# EasyEDA schematic SCH_Active-P1-DSMR-Switch_2025-04-20.json
TITLE: Smart P1 Splitter; REV: 2; Date: 2024-4-21; Sheet: 1/1; Drawn By: Jacco Bezemer; Company: BITS
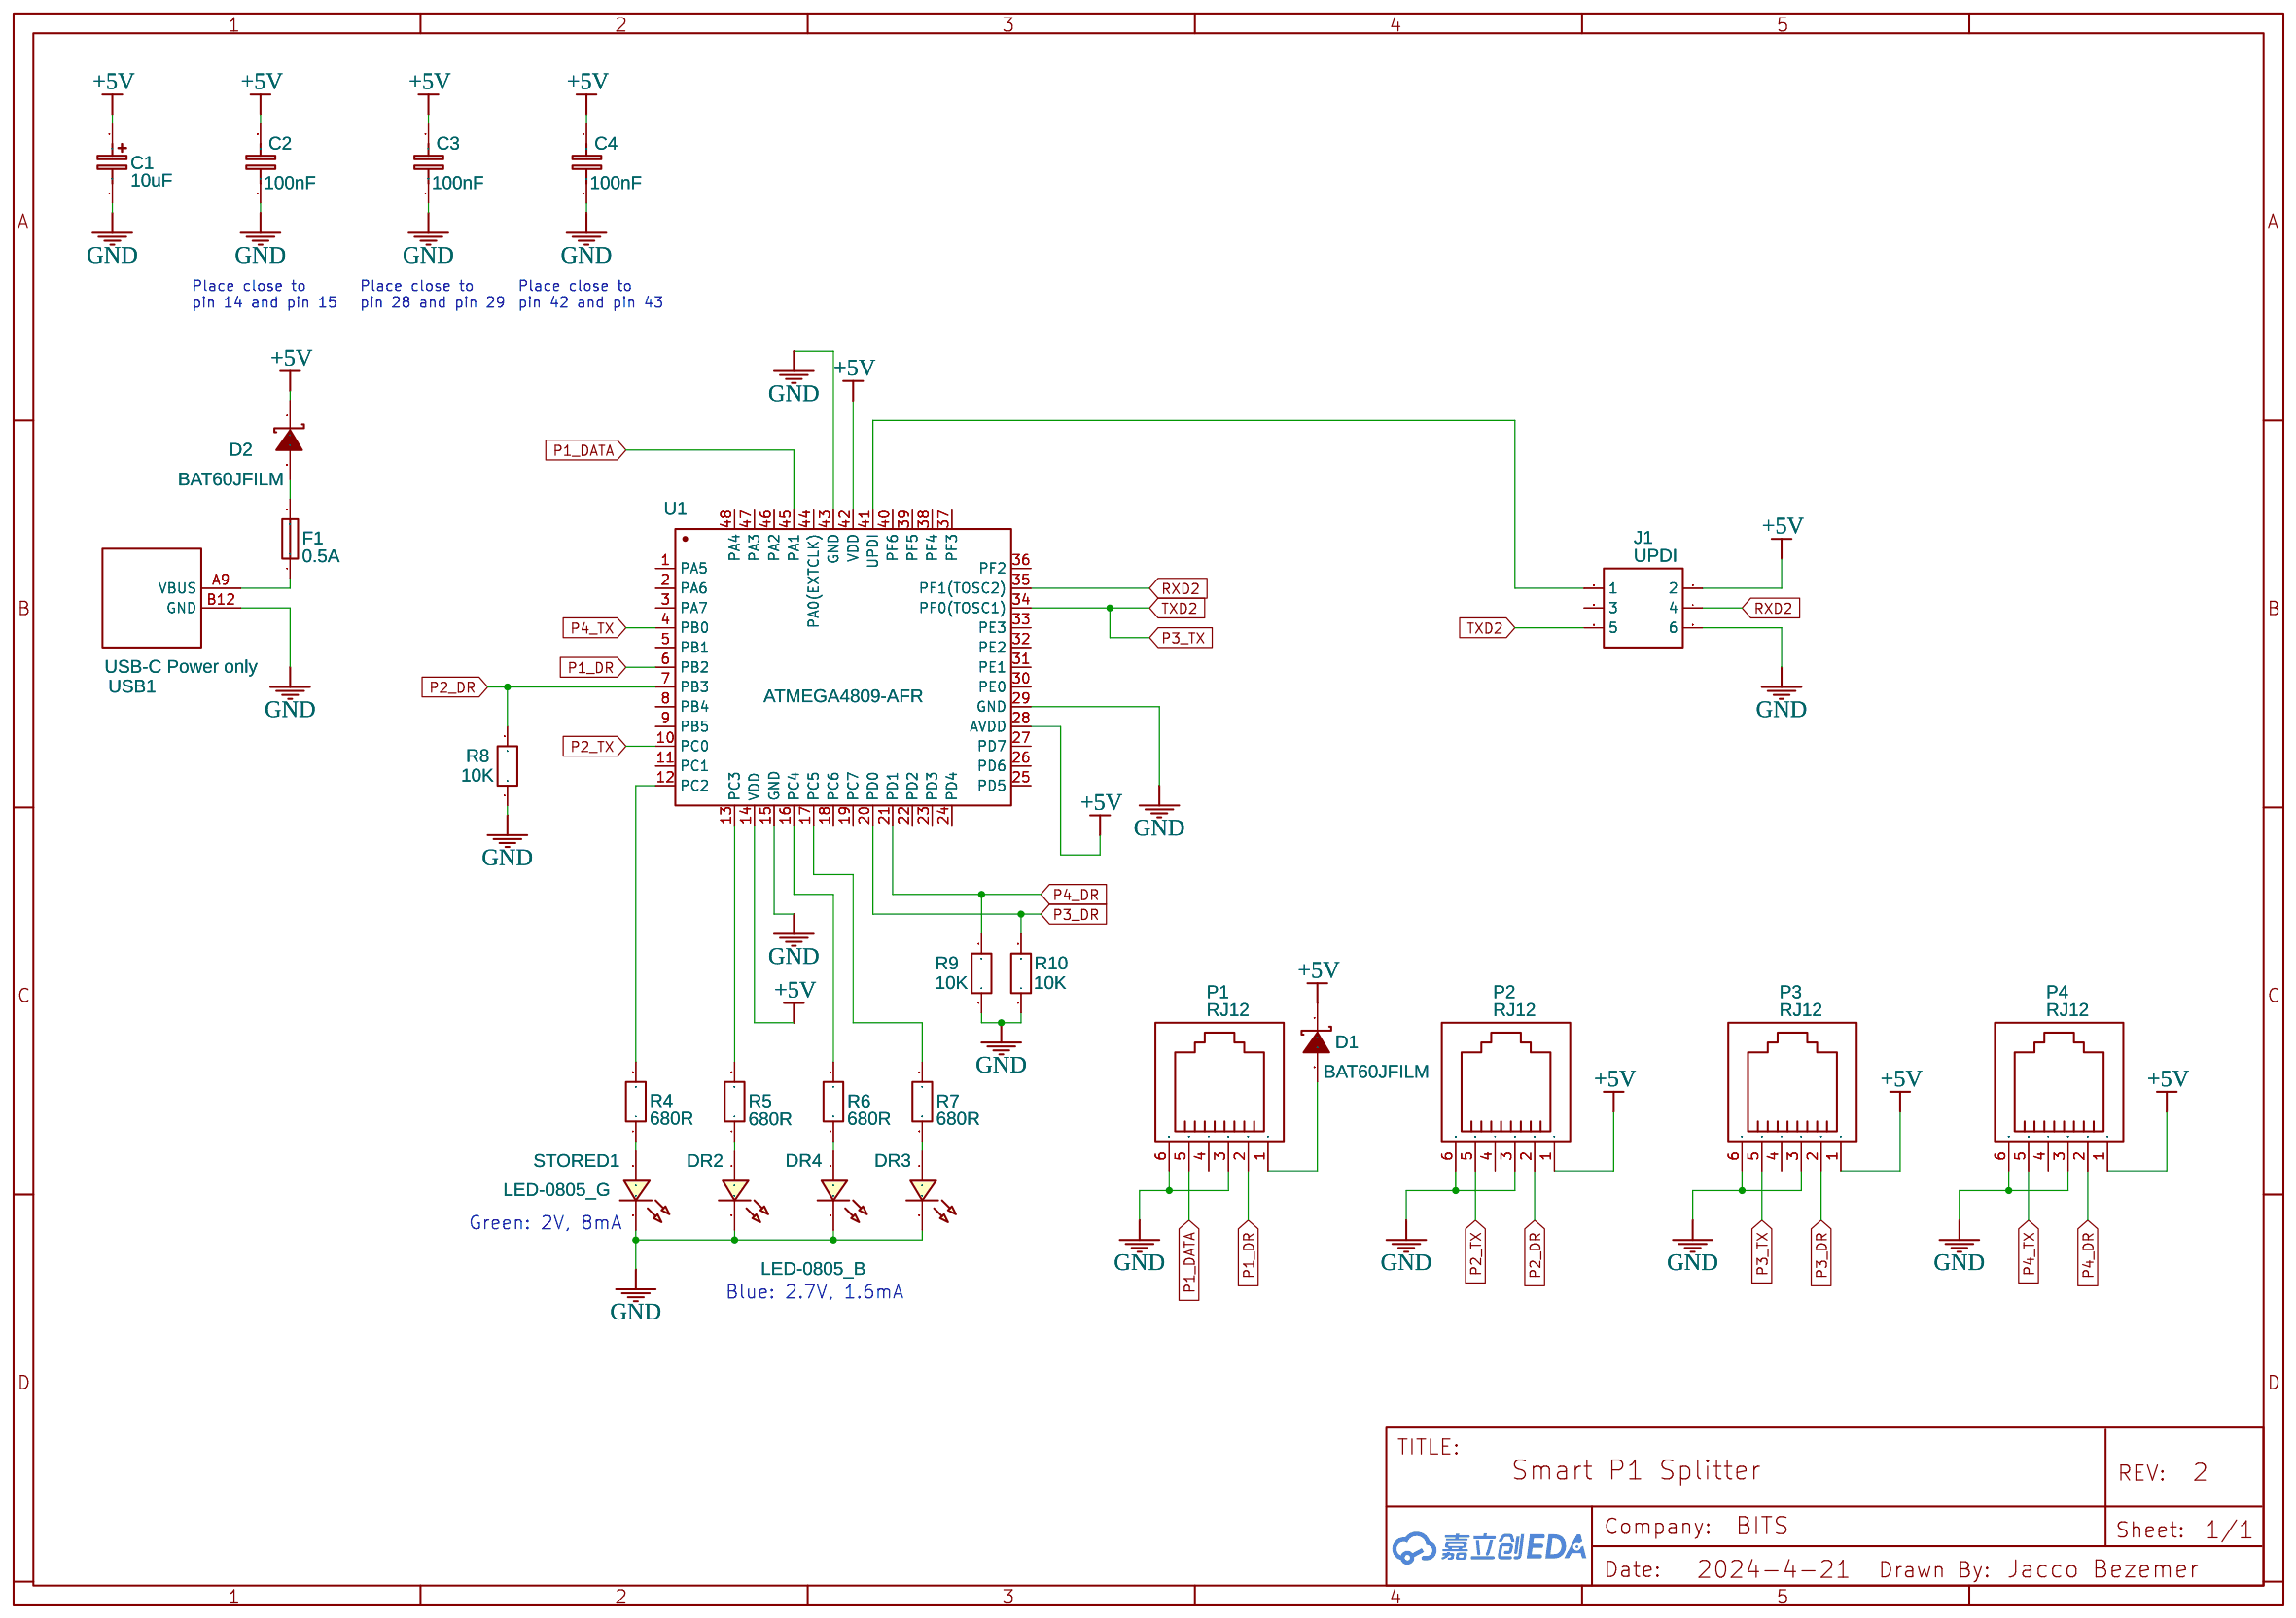
[diagram p0: schematic sheet]

## Parts
C1  10uF  [CAP-D4.0×H5.5]
C2  100nF  [C0805]
C3  100nF  [C0805]
C4  100nF  [C0805]
D1  BAT60JFILM  [SOD-323_L1.8-W1.3-LS2.5-RD]
D2  BAT60JFILM  [SOD-323_L1.8-W1.3-LS2.5-RD]
DR2  LED-0805_B  [LED0805_BLUE]
DR3  LED-0805_B  [LED0805_BLUE]
DR4  LED-0805_B  [LED0805_BLUE]
F1  0.5A  [F0805]
J1  UPDI  [HDR-M-2.54_2X3]
P1  RJ12  [RJ12]
P2  RJ12  [RJ12]
P3  RJ12  [RJ12]
P4  RJ12  [RJ12]
R4  680R  [R0805]
R5  680R  [R0805]
R6  680R  [R0805]
R7  680R  [R0805]
R8  10K  [R0805]
R9  10K  [R0805]
R10  10K  [R0805]
STORED1  LED-0805_G  [LED0805_GREEN]
U1  ATMEGA4809-AFR  [TQFP-48_L7.0-W7.0-P0.50-LS9.0-BL]
USB1  USB-C Power only  [USB-C-TH_TYPE-C-31-M-33]

## Library data of the parts
C1 = CE_SMD_D4.0×H5.5_EU: Contributor: LCEDA_Lib
C2-C4 = C_0805_EU: Contributor: LCEDA_Lib
D1 D2 = BAT60JFILM: Contributor: LCSC; Supplier: LCSC; Manufacturer: ST(意法半导体); Supplier Part: C133103; JLCPCB Part Class: Extended Part
DR2-DR4 = LED-0805_B: Manufacturer: 方舟 ARKLED; Manufacturer Part: D-B080508B1-KS2; Supplier Part: C108412; Contributor: LCEDA_Lib
F1 = 2.5A/32VFUSESMD0805: Supplier: LCSC; Supplier Part: C9900004266; Manufacturer: null; JLCPCB Part Class: Extended Part; link: https://cn.bing.com/search?q=datasheet%3A+%202.5A/32VFUSESMD0805; Contributor: LCSC
J1 = HDR-M-2.54_2x3: Supplier Part: C65114; Supplier: LCSC; Contributor: LCEDA_Lib
P1-P4 = RJ12: Contributor: Jacco Bezemer; Convert to PCB: Yes; Add into BOM: Yes
R4-R10 = R_0805_EU: Contributor: LCEDA_Lib
STORED1 = LED-0805_G: Manufacturer: 国星光电; Manufacturer Part: NCD0805G1; Supplier Part: C84260; Contributor: LCEDA_Lib
U1 = ATMEGA4809-AFR: Contributor: LCSC; Supplier: LCSC; Supplier Part: C189475; Manufacturer: MICROCHIP(美国微芯); JLCPCB Part Class: Extended Part
USB1 = USB-C Power only: Contributor: Jacco Bezemer; JLCPCB Part Class: Extended Part

## Nets
+5V: C1.1 C2.1 C3.1 C4.1 D1.1(K) D2.1(K) J1.2 P2.1 P3.1 P4.1 U1.14(VDD) U1.28(AVDD) U1.42(VDD)
GND: C1.2 C2.2 C3.2 C4.2 DR2.2 DR3.2 DR4.2 J1.6 P1.3 P1.6 P2.3 P2.6 P3.3 P3.6 P4.3 P4.6 R8.1 R9.1 R10.1 STORED1.2 U1.15(GND) U1.29(GND) U1.43(GND) USB1.B12(GND)
P1_DATA: P1.5 U1.45(PA1)
P1_DR: P1.2 U1.6(PB2)
P2_DR: P2.2 R8.2 U1.7(PB3)
P2_TX: P2.5 U1.10(PC0)
P3_DR: P3.2 R10.2 U1.20(PD0)
P3_TX: J1.5 P3.5 U1.34(PF0(TOSC1))
P4_DR: P4.2 R9.2 U1.21(PD1)
P4_TX: P4.5 U1.4(PB0)
RXD2: J1.4 U1.35(PF1(TOSC2))
Net-(D1-2): D1.2(A) P1.1
Net-(D2-2): D2.2(A) F1.2
Net-(DR2-1): DR2.1 R5.1
Net-(DR3-1): DR3.1 R7.2
Net-(DR4-1): DR4.1 R6.2
Net-(F1-1): F1.1 USB1.A9(VBUS)
Net-(J1-1): J1.1 U1.41(UPDI)
Net-(R4-1): R4.1 STORED1.1
Net-(R4-2): R4.2 U1.12(PC2)
Net-(R5-2): R5.2 U1.13(PC3)
Net-(R6-1): R6.1 U1.16(PC4)
Net-(R7-1): R7.1 U1.17(PC5)

Not connected (* = marked no-connect by the designer): J1 3; P1 4; P2 4; P3 4; P4 4; U1 1(PA5) 2(PA6) 3(PA7) 5(PB1) 8(PB4) 9(PB5) 11(PC1) 18(PC6) 19(PC7) 22(PD2) 23(PD3) 24(PD4) 25(PD5) 26(PD6) 27(PD7) 30(PE0) 31(PE1) 32(PE2) 33(PE3) 36(PF2) 37(PF3) 38(PF4) 39(PF5) 40(PF6) 44(PA0(EXTCLK)) 46(PA2) 47(PA3) 48(PA4)

## Notes on the sheet
- Place close to
  pin 14 and pin 15
- Place close to
  pin 28 and pin 29
- Place close to
  pin 42 and pin 43
- Green: 2V, 8mA
- Blue: 2.7V, 1.6mA
